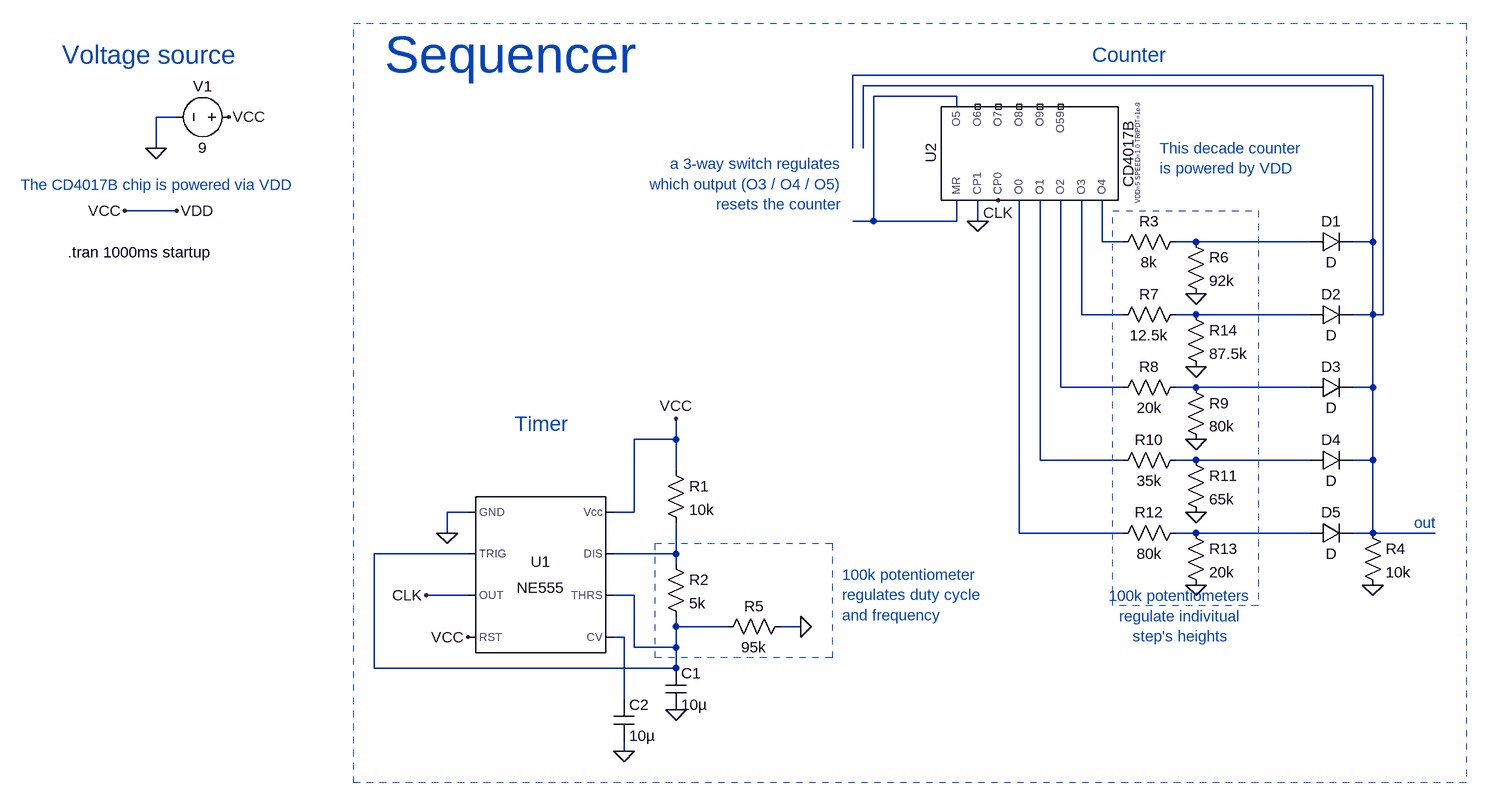
[diagram p0: schematic sequencer-simulation.asc]
sequencer-simulation.asc, the LTspice schematic file:
Version 4.1
SHEET 1 880 680
WIRE 672 -416 -144 -416
WIRE 656 -400 -128 -400
WIRE 16 -384 -112 -384
WIRE 16 -368 16 -384
WIRE -1184 -352 -1216 -352
WIRE -1216 -304 -1216 -352
WIRE -144 -304 -144 -416
WIRE -128 -304 -128 -400
WIRE -1184 -208 -1264 -208
WIRE -112 -192 -112 -384
WIRE -112 -192 -144 -192
WIRE 16 -192 16 -224
WIRE 16 -192 -112 -192
WIRE 48 -192 48 -224
WIRE 240 -160 240 -224
WIRE 272 -160 240 -160
WIRE 384 -160 352 -160
WIRE 560 -160 384 -160
WIRE 656 -160 656 -400
WIRE 656 -160 624 -160
WIRE 208 -48 208 -224
WIRE 272 -48 208 -48
WIRE 384 -48 352 -48
WIRE 560 -48 384 -48
WIRE 656 -48 656 -160
WIRE 656 -48 624 -48
WIRE 672 -48 672 -416
WIRE 672 -48 656 -48
WIRE 176 64 176 -224
WIRE 272 64 176 64
WIRE 384 64 352 64
WIRE 560 64 384 64
WIRE 656 64 656 -48
WIRE 656 64 624 64
WIRE -416 144 -416 112
WIRE -416 144 -480 144
WIRE 144 176 144 -224
WIRE 272 176 144 176
WIRE 384 176 352 176
WIRE 560 176 384 176
WIRE 656 176 656 64
WIRE 656 176 624 176
WIRE -416 192 -416 144
WIRE -736 256 -768 256
WIRE -480 256 -480 144
WIRE -480 256 -512 256
WIRE -768 288 -768 256
WIRE 112 288 112 -224
WIRE 272 288 112 288
WIRE 384 288 352 288
WIRE 560 288 384 288
WIRE 656 288 656 176
WIRE 656 288 624 288
WIRE 752 288 656 288
WIRE -736 320 -880 320
WIRE -416 320 -416 272
WIRE -416 320 -512 320
WIRE -416 336 -416 320
WIRE -736 384 -800 384
WIRE -480 384 -512 384
WIRE -416 432 -416 416
WIRE -336 432 -416 432
WIRE -224 432 -256 432
WIRE -496 448 -512 448
WIRE -480 464 -480 384
WIRE -416 464 -416 432
WIRE -416 464 -480 464
WIRE -880 496 -880 320
WIRE -416 496 -416 464
WIRE -416 496 -880 496
WIRE -496 544 -496 448
WIRE -496 624 -496 608
FLAG -416 560 0
FLAG -800 384 CLK
FLAG -768 288 0
FLAG 80 -224 CLK
FLAG 48 -192 0
FLAG 656 368 0
FLAG -496 624 0
FLAG -416 112 VCC
FLAG -736 448 VCC
FLAG -224 432 0
FLAG 384 32 0
FLAG 384 -80 0
FLAG 384 144 0
FLAG 384 256 0
FLAG 384 368 0
FLAG -1104 -352 VCC
FLAG -1216 -304 0
FLAG -1264 -208 VCC
FLAG -1184 -208 VDD
SYMBOL Misc\\NE555 -624 352 R0
SYMATTR InstName U1
SYMBOL res -432 176 R0
SYMATTR InstName R1
SYMATTR Value 10k
SYMBOL res -432 320 R0
SYMATTR InstName R2
SYMATTR Value 5k
SYMBOL cap -432 496 R0
SYMATTR InstName C1
SYMATTR Value 10µ
SYMBOL CD4017B 128 -288 R270
WINDOW 39 8 160 Top 0
SYMATTR InstName U2
SYMBOL res 368 -176 R90
WINDOW 0 0 56 VBottom 2
WINDOW 3 32 56 VTop 2
SYMATTR InstName R3
SYMATTR Value 8k
SYMBOL res 640 272 R0
SYMATTR InstName R4
SYMATTR Value 10k
SYMBOL cap -512 544 R0
SYMATTR InstName C2
SYMATTR Value 10µ
SYMBOL res -240 416 R90
WINDOW 0 0 56 VBottom 2
WINDOW 3 32 56 VTop 2
SYMATTR InstName R5
SYMATTR Value 95k
SYMBOL res 368 -176 R0
SYMATTR InstName R6
SYMATTR Value 92k
SYMBOL diode 560 -144 R270
WINDOW 0 32 32 VTop 2
WINDOW 3 0 32 VBottom 2
SYMATTR InstName D1
SYMBOL res 368 -64 R90
WINDOW 0 0 56 VBottom 2
WINDOW 3 32 56 VTop 2
SYMATTR InstName R7
SYMATTR Value 12.5k
SYMBOL res 368 48 R90
WINDOW 0 0 56 VBottom 2
WINDOW 3 32 56 VTop 2
SYMATTR InstName R8
SYMATTR Value 20k
SYMBOL res 368 48 R0
SYMATTR InstName R9
SYMATTR Value 80k
SYMBOL res 368 160 R90
WINDOW 0 0 56 VBottom 2
WINDOW 3 32 56 VTop 2
SYMATTR InstName R10
SYMATTR Value 35k
SYMBOL res 368 160 R0
SYMATTR InstName R11
SYMATTR Value 65k
SYMBOL res 368 272 R90
WINDOW 0 0 56 VBottom 2
WINDOW 3 32 56 VTop 2
SYMATTR InstName R12
SYMATTR Value 80k
SYMBOL res 368 272 R0
SYMATTR InstName R13
SYMATTR Value 20k
SYMBOL diode 560 -32 R270
WINDOW 0 32 32 VTop 2
WINDOW 3 0 32 VBottom 2
SYMATTR InstName D2
SYMBOL diode 560 80 R270
WINDOW 0 32 32 VTop 2
WINDOW 3 0 32 VBottom 2
SYMATTR InstName D3
SYMBOL diode 560 192 R270
WINDOW 0 32 32 VTop 2
WINDOW 3 0 32 VBottom 2
SYMATTR InstName D4
SYMBOL diode 560 304 R270
WINDOW 0 32 32 VTop 2
WINDOW 3 0 32 VBottom 2
SYMATTR InstName D5
SYMBOL res 368 -64 R0
SYMATTR InstName R14
SYMATTR Value 87.5k
SYMBOL voltage -1088 -352 R90
WINDOW 0 -32 56 VBottom 2
WINDOW 3 32 56 VTop 2
SYMATTR InstName V1
SYMATTR Value 9
TEXT 328 -304 Left 2 ;This decade counter\nis powered by VDD
TEXT -160 -280 Right 2 ;a 3-way switch regulates\nwhich output (O3 / O4 / O5)\nresets the counter
TEXT -864 -448 Left 6 ;Sequencer
TEXT -160 352 Left 2 ;100k potentiometer\nregulates duty cycle\nand frequency
TEXT 360 416 Center 2 ;100k potentiometers\nregulate indivitual\nstep's heights
TEXT -664 120 Left 3 ;Timer
TEXT 224 -448 Left 3 ;Counter
TEXT -1352 -144 Left 2 !.tran 1000ms startup
TEXT -1360 -448 Left 4 ;Voltage source
TEXT -1424 -248 Left 2 ;The CD4017B chip is powered via VDD
TEXT 720 272 Left 2 ;out
RECTANGLE Normal -912 -496 800 672 2
RECTANGLE Normal -176 480 -448 304 2
RECTANGLE Normal 256 -208 480 400 2

The netlist it stands for:
* sequencer-simulation.asc
X§U1 0 N013 CLK VDD N015 N013 N014 VDD NE555  ; pins GND TRIG OUT RST CV THRS DIS Vcc
R1 VDD N014 10k
R2 N014 N013 5k
C1 N013 0 10µ
X§U2 N002 0 CLK N011 N009 N007 N005 N003 N002 NC_01 NC_02 NC_03 NC_04 NC_05 VDD 0 CD4017B VDD=5 SPEED=1.0 TRIPDT=1e-9  ; pins MR CP1 CP0 O0 O1 O2 O3 O4 O5 O6 O7 O8 O9 O59
R3 N004 N003 8k
R4 N001 0 10k
C2 N015 0 10µ
R5 0 N013 95k
R6 N004 0 92k
D1 N004 N001 D
R7 N006 N005 12.5k
R8 N008 N007 20k
R9 N008 0 80k
R10 N010 N009 35k
R11 N010 0 65k
R12 N012 N011 80k
R13 N012 0 20k
D2 N006 N001 D
D3 N008 N001 D
D4 N010 N001 D
D5 N012 N001 D
R14 N006 0 87.5k
V1 VDD 0 9
.model D D
.lib standard.dio
* This decade counter
* is powered by VDD
* a 3-way switch regulates
* which output (O3 / O4 / O5)
* resets the counter
* Sequencer
* 100k potentiometer
* regulates duty cycle
* and frequency
* 100k potentiometers
* regulate indivitual
* step's heights
* Timer
* Counter
.tran 1000ms startup
* Voltage source
* The CD4017B chip is powered via VDD
* out
.lib NE555.sub
.lib CD4000_v.lib
.backanno
.end